# Altium schematic sheet mpu9250.schdoc
size 292 x 205 mm; Device: A_A4; Symbol: A_A4; Name: A_A4; Designator: A; @Project Name: Sheet_1; REV: 1.0; Date: 2026-09-20; Sheet: 1/1; Draw By: sant85082; Company: Your Company; Manufacturer Part: ?; Convert to PCB: yes; Add into BOM: yes; Origin Footprint: NONE; Unique ID: frame_lib_1
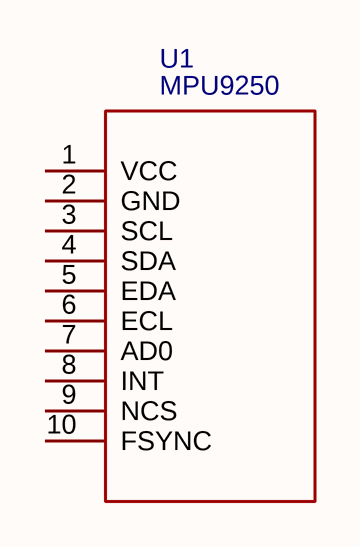
[diagram p0: mpu9250.schdoc]

## Parts
U1  MPU9250

## Nets

Not connected (* = marked no-connect by the designer): U1 1(VCC) 2(GND) 3(SCL) 4(SDA) 5(EDA) 6(ECL) 7(AD0) 8(INT) 9(NCS) 10(FSYNC)

## Notes on the sheet
- TITLE:
- Sheet_1
- Company:
- Your Company
- Sheet:
- REV:
- 1.0
- 1/1
- Date:
- 2026-09-20
- Drawn By:
- sant85082

## Library data of the parts
U1 = MPU9250: Convert to PCB: yes; UniqueId: ggeced1d0be2aca014c; Device: MPU9250; Add into BOM: yes; Origin Footprint: MPU9250; SymbolName: MPU9250